# EAGLE design tulip breakout (EAGLE 9.6.2)
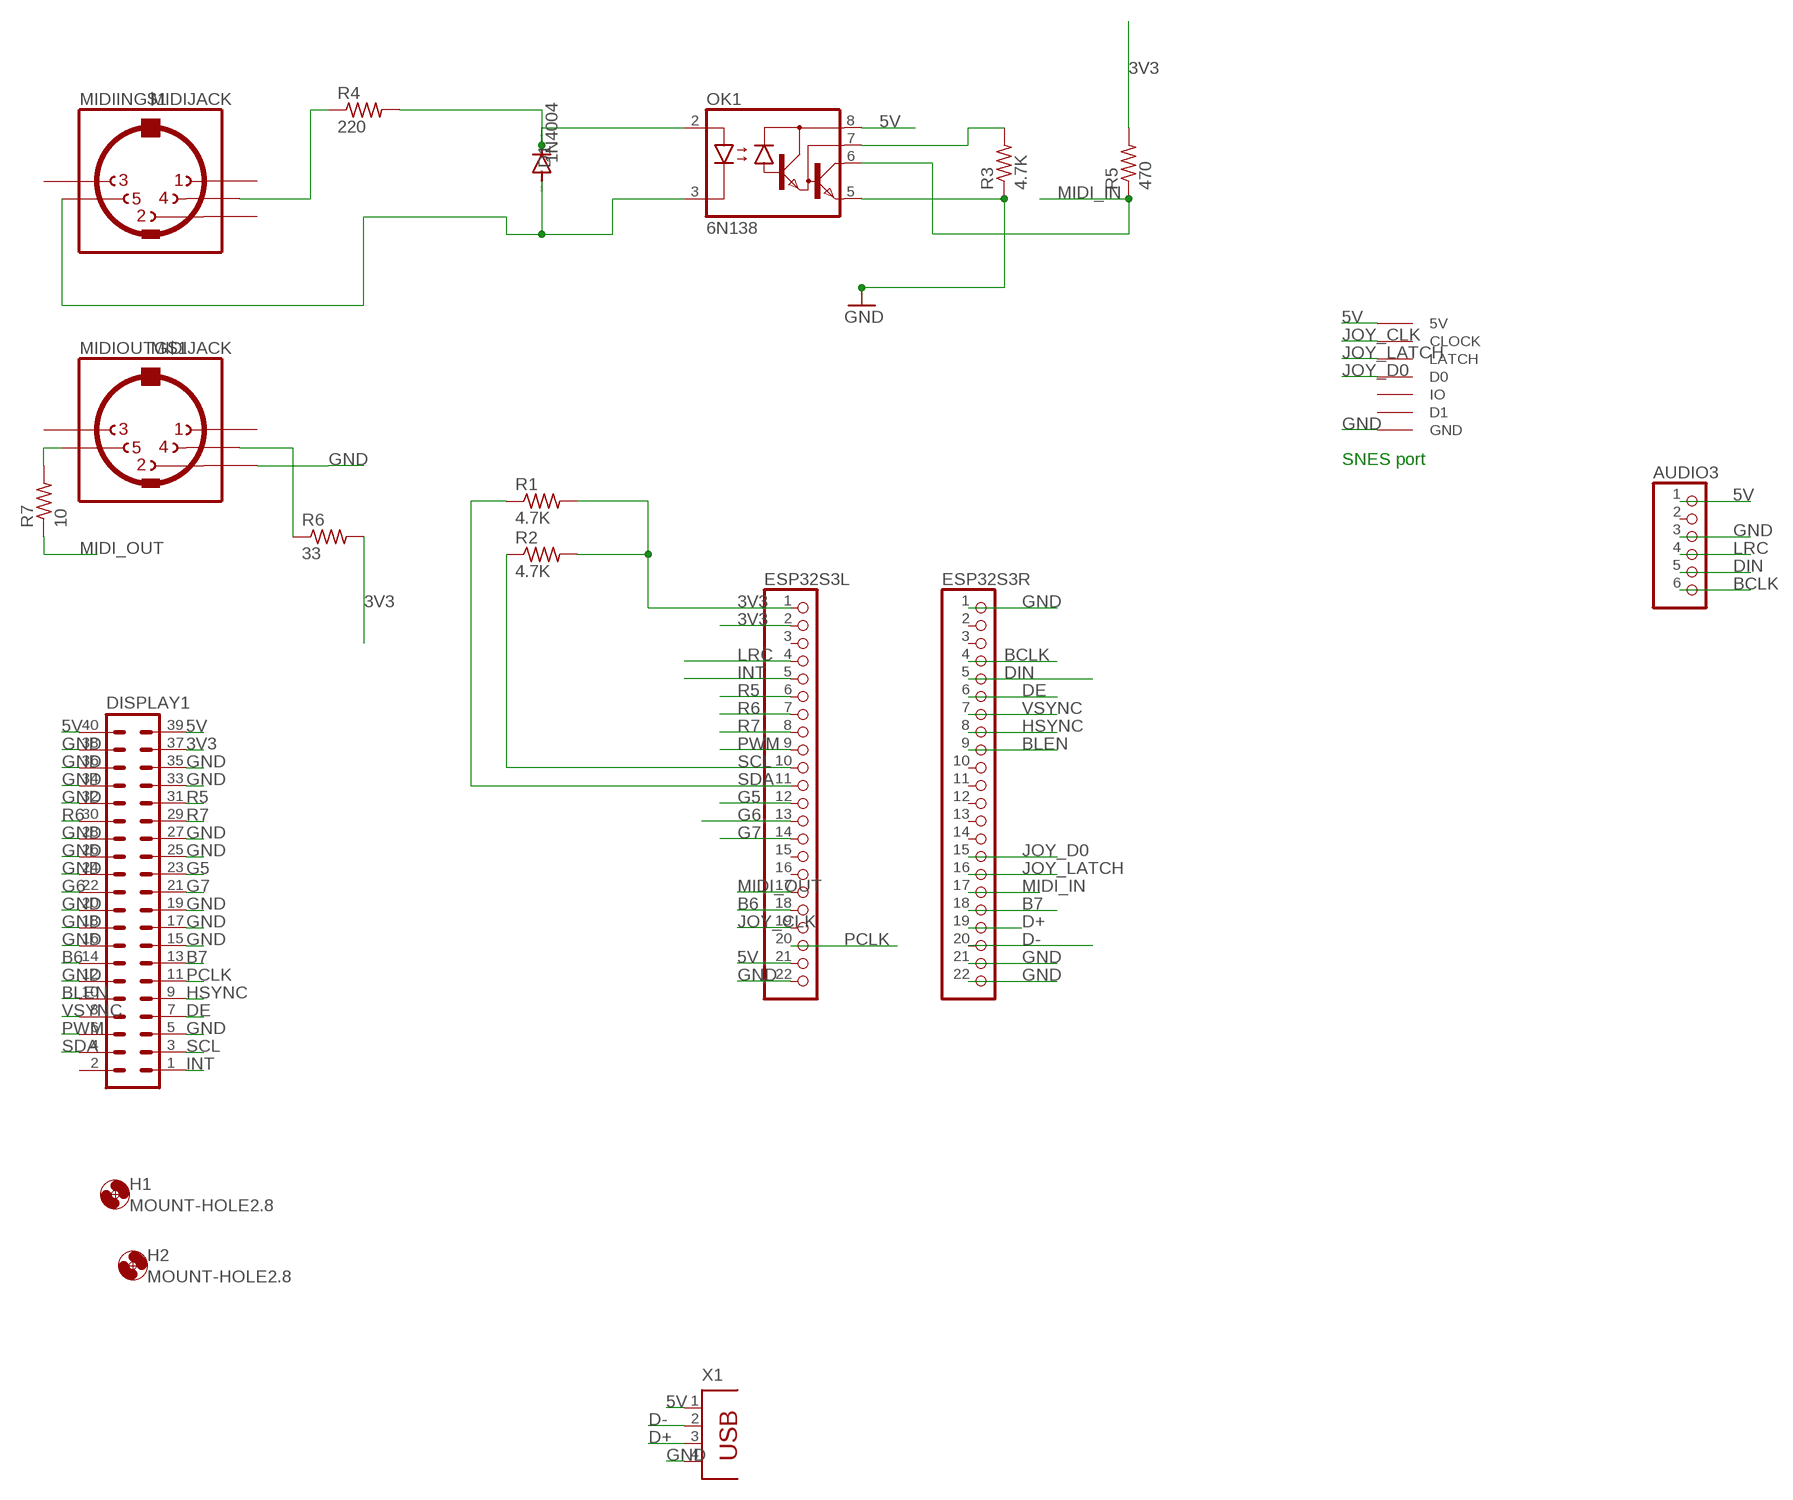
[diagram p0: schematic, sheet 1]

## Parts
AUDIO3  PINHD-1X6  [1X06]
D1  1N4004  [DO41-10]
DISPLAY1  MA20-2  [MA20-2]
ESP32S3L  PINHD-1X22  [1X22]
ESP32S3R  PINHD-1X22  [1X22]
H1  MOUNT-HOLE2.8  [2,8]
H2  MOUNT-HOLE2.8  [2,8]
MIDIIN  MIDIJACK  [CP-2350]
MIDIOUT  MIDIJACK  [CP-2350]
OK1  6N138  [DIL08]
R1  4.7K  R-US_0207/12  [0207/12]
R2  4.7K  R-US_0207/12  [0207/12]
R3  4.7K  R-US_0207/12  [0207/12]
R4  220  R-US_0207/12  [0207/12]
R5  470  R-US_0207/12  [0207/12]
R6  33  R-US_0207/12  [0207/12]
R7  10  R-US_0207/12  [0207/12]
U$2  SNESCONN  [SNESCONN]
X1  PN87520  [PN87520]

## Nets
3V3: DISPLAY1.37 ESP32S3L.1 ESP32S3L.2 R1.2 R2.2 R5.2 R6.2
5V: AUDIO3.1 DISPLAY1.39 DISPLAY1.40 ESP32S3L.21 OK1.8(VCC) U$2.5V X1.1
B6: DISPLAY1.14 ESP32S3L.18
B7: DISPLAY1.13 ESP32S3R.18
BCLK: AUDIO3.6 ESP32S3R.4
BLEN: DISPLAY1.10 ESP32S3R.9
D+: ESP32S3R.19 X1.3
D-: ESP32S3R.20 X1.2
DE: DISPLAY1.7 ESP32S3R.6
DIN: AUDIO3.5 ESP32S3R.5
G5: DISPLAY1.23 ESP32S3L.12
G6: DISPLAY1.22 ESP32S3L.13
G7: DISPLAY1.21 ESP32S3L.14
GND: AUDIO3.3 DISPLAY1.5 DISPLAY1.12 DISPLAY1.15 DISPLAY1.16 DISPLAY1.17 DISPLAY1.18 DISPLAY1.19 DISPLAY1.20 DISPLAY1.24 DISPLAY1.25 DISPLAY1.26 DISPLAY1.27 DISPLAY1.28 DISPLAY1.32 DISPLAY1.33 DISPLAY1.34 DISPLAY1.35 DISPLAY1.36 DISPLAY1.38 ESP32S3L.22 ESP32S3R.1 ESP32S3R.21 ESP32S3R.22 MIDIOUT.2 OK1.5(GND) R3.1 U$2.GND X1.4
HSYNC: DISPLAY1.9 ESP32S3R.8
INT: DISPLAY1.1 ESP32S3L.5
JOY_CLK: ESP32S3L.19 U$2.CLOCK
JOY_D0: ESP32S3R.15 U$2.D0
JOY_LATCH: ESP32S3R.16 U$2.LATCH
LRC: AUDIO3.4 ESP32S3L.4
MIDI_IN: ESP32S3R.17 OK1.6(VO) R5.1
MIDI_OUT: ESP32S3L.17 R7.1
N$29: MIDIIN.4 R4.1
N$30: D1.C OK1.2(A) R4.2
N$31: D1.A MIDIIN.5 OK1.3(C)
N$32: OK1.7(VB) R3.2
N$34: MIDIOUT.5 R7.2
N$35: MIDIOUT.4 R6.1
PCLK: DISPLAY1.11 ESP32S3L.20
PWM: DISPLAY1.6 ESP32S3L.9
R5: DISPLAY1.31 ESP32S3L.6
R6: DISPLAY1.30 ESP32S3L.7
R7: DISPLAY1.29 ESP32S3L.8
SCL: DISPLAY1.3 ESP32S3L.10 R2.1
SDA: DISPLAY1.4 ESP32S3L.11 R1.1
VSYNC: DISPLAY1.8 ESP32S3R.7
Unconnected: AUDIO3.2 DISPLAY1.2 ESP32S3L.3 ESP32S3L.15 ESP32S3L.16 ESP32S3R.2 ESP32S3R.3 ESP32S3R.10 ESP32S3R.11 ESP32S3R.12 ESP32S3R.13 ESP32S3R.14 MIDIIN.1 MIDIIN.2 MIDIIN.3 MIDIIN.PE1(MT) MIDIIN.PE2(MT) MIDIIN.PE(MT) MIDIIN.PE@(MT) MIDIOUT.1 MIDIOUT.3 MIDIOUT.PE1(MT) MIDIOUT.PE2(MT) MIDIOUT.PE(MT) MIDIOUT.PE@(MT) U$2.D1 U$2.IO

## Notes on the sheet
- SNES port

## Library data of the parts
AUDIO3 = pinhead:PINHD-1X6: PIN HEADER
D1 = diode:1N4004: DIODE general purpose rectifier, 1 A
DISPLAY1 = con-lstb:MA20-2: PIN HEADER; OC_FARNELL: unknown; OC_NEWARK: unknown
ESP32S3L ESP32S3R = pinhead:PINHD-1X22: PIN HEADER
H1 H2 = holes:MOUNT-HOLE: MOUNTING HOLE with drill center marker
MIDIIN MIDIOUT = adafruit:MIDIJACK: DIN 5 jack also known as MIDI jack A modification of conn-hirshman:MAB5SH with two options for the grounding 'teeth'
OK1 = optocoupler:6N138: MOTOROLA OPTO COUPLER; MF: VISHAY/TELEFUNKEN; MPN: 6N138; OC_FARNELL: 9860150; OC_NEWARK: 35K5294
R1-R7 = rcl:R-US_: RESISTOR, American symbol; SPICEPREFIX: R
U$2 = gamepad-conn:SNESCONN
X1 = con-berg:PN87520: BERG USB connector; OC_FARNELL: unknown; OC_NEWARK: unknown

## Board
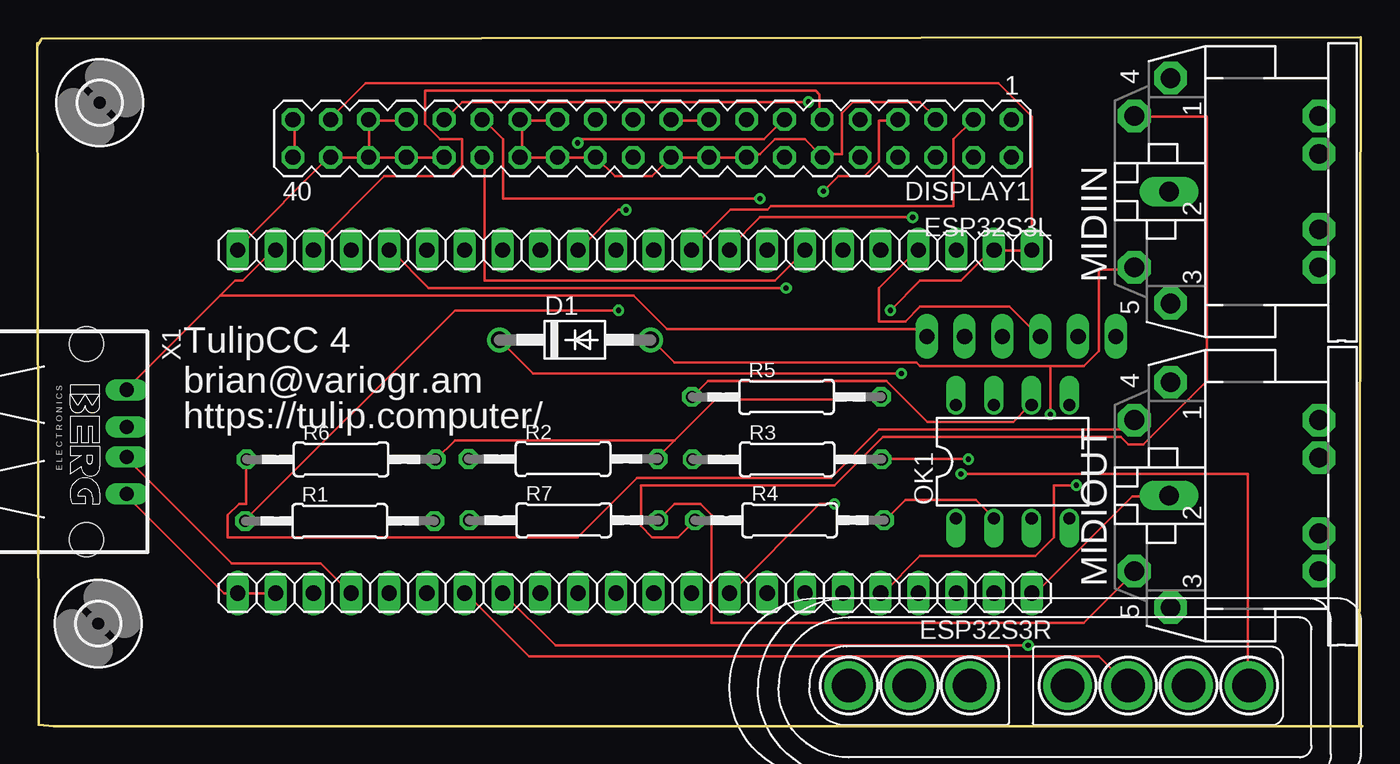
[diagram p1: board, top side]
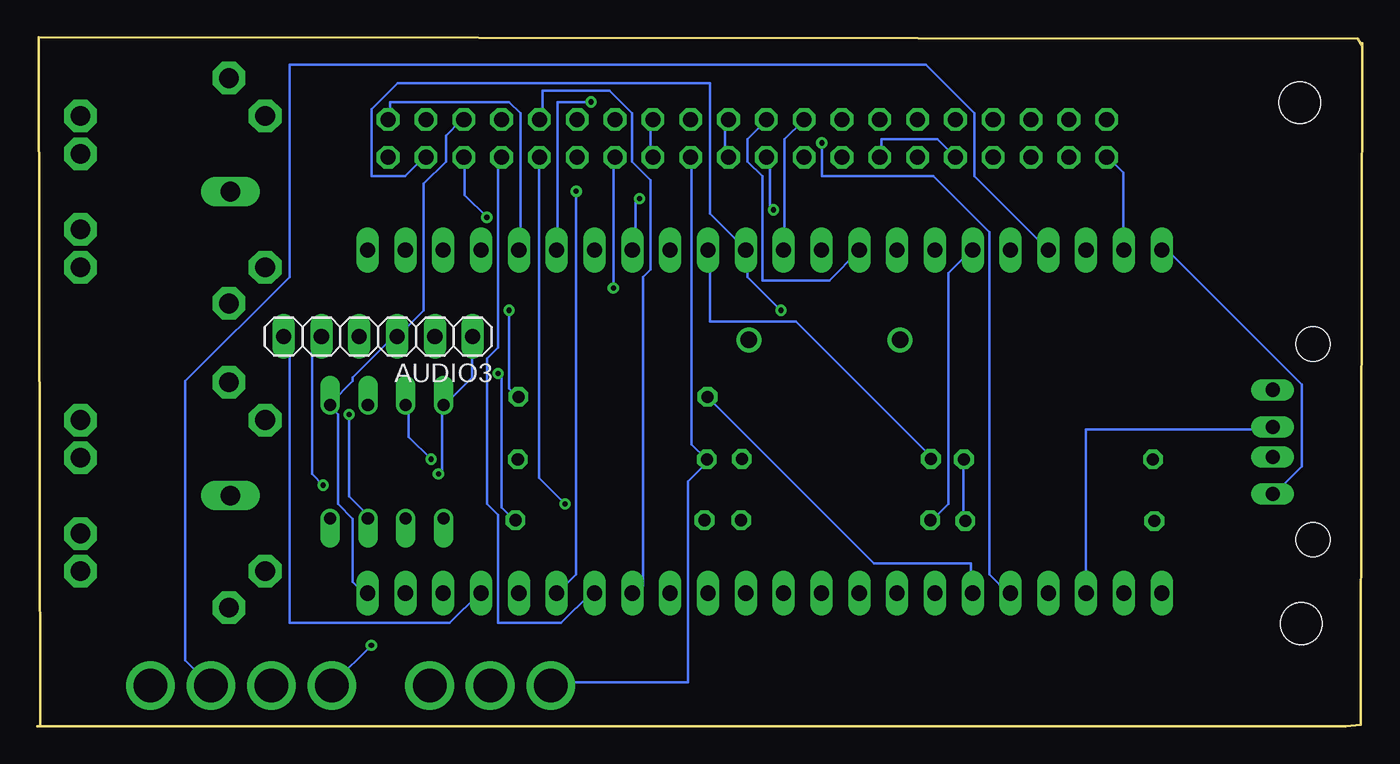
[diagram p2: board, bottom side, seen from below]

Size 89 x 46.3 mm. Coordinates in mm from the lower left corner, seen from the top.
Outline: 0,45.9 0,45.7
Outline: 0,45.7 0.1,2.8
Outline: 88.8,0 88.9,46.3 0.3,46.2 0,45.7
Outline: 89,0 1.1,0 0.1,0.1 0.1,3.3
Copper layers (1*16): Top 0.035mm / dielectric 0.15mm / Bottom 0.035mm
Design rules "default *": minimum track width 6mil, minimum drill 0.35mm, track to track 10mil, track to pad 10mil, pad to pad 10mil, via to via 10mil, smd to smd 10mil, copper to edge 40mil, drill to drill 6mil, minimum pad ring 10mil, minimum via ring 8mil, stop-mask expansion 4mil, vias tented up to drill 0mil, thermal gap 10mil

### Footprints (pad centres in the part's own frame; a part is rotated, then mirrored left to right if it is on the bottom)
1X06 = drill 1.016 long: 1 -6.35,0; 2 -3.81,0; 3 -1.27,0; 4 1.27,0; 5 3.81,0; 6 6.35,0
DO41-10 = drill 1.118: A 5.08,0; C -5.08,0
MA20-2 = drill 1.016 octagon: 1 -24.13,-1.27; 2 -24.13,1.27; 3 -21.59,-1.27; 4 -21.59,1.27; 5 -19.05,-1.27; 6 -19.05,1.27; 7 -16.51,-1.27; 8 -16.51,1.27; 9 -13.97,-1.27; 10 -13.97,1.27; 11 -11.43,-1.27; 12 -11.43,1.27; 13 -8.89,-1.27; 14 -8.89,1.27; 15 -6.35,-1.27; 16 -6.35,1.27; 17 -3.81,-1.27; 18 -3.81,1.27; 19 -1.27,-1.27; 20 -1.27,1.27; 21 1.27,-1.27; 22 1.27,1.27; 23 3.81,-1.27; 24 3.81,1.27; 25 6.35,-1.27; 26 6.35,1.27; 27 8.89,-1.27; 28 8.89,1.27; 29 11.43,-1.27; 30 11.43,1.27; 31 13.97,-1.27; 32 13.97,1.27; 33 16.51,-1.27; 34 16.51,1.27; 35 19.05,-1.27; 36 19.05,1.27; 37 21.59,-1.27; 38 21.59,1.27; 39 24.13,-1.27; 40 24.13,1.27
1X22 = drill 1.016 long: 1 -26.67,0; 2 -24.13,0; 3 -21.59,0; 4 -19.05,0; 5 -16.51,0; 6 -13.97,0; 7 -11.43,0; 8 -8.89,0; 9 -6.35,0; 10 -3.81,0; 11 -1.27,0; 12 1.27,0; 13 3.81,0; 14 6.35,0; 15 8.89,0; 16 11.43,0; 17 13.97,0; 18 16.51,0; 19 19.05,0; 20 21.59,0; 21 24.13,0; 22 26.67,0
2,8 = hole 2.8: 0,0
CP-2350 = drill 1.321 pad 2.184 octagon: 1 7.62,12.58; 3 -7.52,12.58; 4 5.08,15.02; 5 -5.08,15.02; PE -2.54,2.62; PE1 -5.08,2.62; PE2 5.08,2.62; PE@ 2.54,2.62 | drill 1.321 long: 2 0,12.68
DIL08 = drill 0.813 offset: 1 -3.81,-3.81; 2 -1.27,-3.81; 3 1.27,-3.81; 4 3.81,-3.81; 5 3.81,3.81; 6 1.27,3.81; 7 -1.27,3.81; 8 -3.81,3.81
0207/12 = drill 0.813 octagon: 1 -6.35,0; 2 6.35,0
SNESCONN = drill 2.25 pad 3.25: 5V 0,4.064; CLOCK 4.064,4.064; D0 12.192,4.064; D1 18.756,4.064; GND 26.884,4.064; IO 22.82,4.064; LATCH 8.128,4.064
PN87520 = drill 0.95 long: 1 -3.5,2.71; 2 -1,2.71; 3 1,2.71; 4 3.5,2.71 | hole 2.3: -6.57,0; 6.57,0

### Placement (x,y rotation side)
AUDIO3  66.1,26.2 180 bottom
D1  36.12,25.97 0 top
DISPLAY1  41.3,39.5 180 top
ESP32S3L  40.14,32 180 top
ESP32S3R  40.14,8.95 180 top
H1  4.1,6.9 0 top
H2  4.2,41.9 0 top
MIDIIN  88.71,35.93 90 top
MIDIOUT  88.71,15.5 90 top
OK1  65.52,17.78 0 top
R1  20.32,13.79 0 top
R2  35.32,17.97 0 top
R3  50.37,17.94 0 top
R4  50.53,13.85 0 top
R5  50.33,22.14 0 top
R6  20.41,17.94 0 top
R7  35.37,13.85 0 top
U$2  81.4,6.8 180 top
X1  3.31,19.11 270 top

### Tracks (layer width: path | path; a pad name or v marks a point on that pad's centre or on a via)
3V3  (via drill 0.35)
  Top 0.152: 42.8,19.2 45.55,21.95 56.55,21.95 R5.2 | 42.8,19.2 41.8,18.2 R2.2 | 42.8,19.2 28.05,19.2 26.8,17.95 R6.2 | DISPLAY1.37 19.8,40.95 22.05,43.2 64.55,43.2 66.8,40.95 66.8,32.2 ESP32S3L.1 66.8,31.95 64.3,31.95 ESP32S3L.2 64.05,31.95 62.05,29.95 59.3,29.95 v57.3,27.95
  Bottom 0.152: R1.2 26.8,13.95 26.8,17.7 R6.2 | v57.3,27.95 57.3,22.7 56.8,22.2 R5.2
5V  (via drill 0.35)
  Top 0.152: DISPLAY1.40 17.3,38.45 17.3,40.7 DISPLAY1.39 | 12.3,28.95 13.3,29.95 13.8,29.95 15.8,31.95 ESP32S3L.21 | 12.3,28.95 6.05,22.7 X1.1 | 12.3,28.95 40.05,28.95 42.3,26.7 59.05,26.7 59.55,26.2 AUDIO3.1 | v62.05,16.95 81.3,16.95 81.3,2.95 U$2.5V
  Bottom 0.152: AUDIO3.1 59.8,26.2 59.8,23.45 61.55,21.7 OK1.8 61.8,21.45 61.8,17.2 v62.05,16.95 | DISPLAY1.40 17.05,38.2 16.05,37.2 16.05,32.2 ESP32S3L.21
B6  (via drill 0.35)
  Top 0.152: v50.3,29.45 26.3,29.45 23.8,31.95 ESP32S3L.18
  Bottom 0.152: v50.3,29.45 50.3,38.2 DISPLAY1.14
B7  (via drill 0.35)
  Top 0.152: v36.3,39.2 36.55,39.45 48.8,39.45 50.05,40.7 DISPLAY1.13
  Bottom 0.152: v36.3,39.2 36.3,36.95 28.8,36.95 25.05,33.2 25.05,10.2 23.8,8.95 ESP32S3R.18
BCLK
  Bottom 0.152: ESP32S3R.4 59.3,8.95 61.3,6.95 72.05,6.95 72.05,25.95 72.3,26.2 AUDIO3.6
BLEN  (via drill 0.35)
  Top 0.152: v53.55,14.95 52.55,14.95 46.55,8.95 ESP32S3R.9
  Bottom 0.152: v53.55,14.95 55.3,16.7 55.3,38.2 DISPLAY1.10
D+
  Top 0.152: X1.3 6.05,17.95 13.05,10.95 19.05,10.95 21.05,8.95 ESP32S3R.19
D-
  Bottom 0.152: ESP32S3R.20 18.55,19.95 6.05,19.95 X1.2
DE  (via drill 0.35)
  Top 0.152: v52.8,35.95 53.8,36.95 55.55,36.95 56.55,37.95 56.55,40.7 57.8,40.7 DISPLAY1.7
  Bottom 0.152: v52.8,35.95 52.8,10.2 54.05,8.95 ESP32S3R.6
DIN  (via drill 0.35)
  Top 0.152: v69.8,16.2 68.3,16.2 68.3,12.7 67.05,11.45 59.3,11.45 56.8,8.95 ESP32S3R.5
  Bottom 0.152: v69.8,16.2 70.55,16.95 70.55,25.7 70.05,26.2 AUDIO3.5
G5
  Bottom 0.152: ESP32S3L.12 38.8,32.2 38.8,39.45 37.55,40.7 DISPLAY1.23
G6  (via drill 0.35)
  Top 0.152: v39.55,34.7 39.05,34.7 36.55,32.2 ESP32S3L.13
  Bottom 0.152: v39.55,34.7 39.8,34.95 39.8,38.2 DISPLAY1.22
G7
  Bottom 0.152: ESP32S3L.14 33.8,31.95 35.8,29.95 40.3,29.95 40.3,36.95 41.3,37.95 41.3,39.45 40.05,40.7 DISPLAY1.21
GND
  Top 0.152: X1.4 6.05,15.45 12.55,8.95 ESP32S3R.22 ESP32S3R.21 | 22.3,40.7 24.55,40.7 DISPLAY1.33 | DISPLAY1.36 22.3,38.2 24.55,38.2 DISPLAY1.34 24.8,38.2 27.3,38.2 DISPLAY1.32 | 22.3,40.7 22.3,38.45 DISPLAY1.36 | 22.3,40.7 DISPLAY1.35 | ESP32S3L.22 13.55,32.2 19.55,38.2 DISPLAY1.38 19.8,38.2 22.05,38.2 DISPLAY1.36 | ESP32S3R.1 67.05,8.95 73.55,15.45 75.8,15.45 MIDIOUT.2 | 32.55,40.7 34.8,40.7 DISPLAY1.25 | 32.55,40.7 32.55,38.45 DISPLAY1.28 32.55,38.2 34.8,38.2 DISPLAY1.26 35.05,38.2 37.3,38.2 DISPLAY1.24 37.55,38.2 38.8,36.95 41.3,36.95 42.55,38.2 DISPLAY1.20 42.8,38.2 45.05,38.2 DISPLAY1.18 45.3,38.2 47.55,38.2 DISPLAY1.16 47.8,38.45 48.55,38.45 49.55,39.45 51.55,39.45 52.55,38.45 DISPLAY1.12 52.8,38.45 54.05,38.45 54.05,41.2 54.8,41.95 59.3,41.95 60.3,40.95 DISPLAY1.5 | 32.55,40.7 DISPLAY1.27 | DISPLAY1.19 42.8,40.7 45.05,40.7 DISPLAY1.17
  Bottom 0.152: X1.4 5.8,15.7 4.05,17.45 4.05,22.95 13.3,32.2 ESP32S3L.22 | ESP32S3R.1 67.05,8.95 67.8,9.7 67.8,13.95 68.8,14.95 68.8,20.95 69.3,21.45 OK1.5 69.3,21.7 67.8,23.2 67.8,23.45 65.05,26.2 AUDIO3.3 64.8,26.2 63.05,27.95 63.05,36.45 61.55,37.95 61.55,39.7 60.55,40.7 DISPLAY1.5 | DISPLAY1.18 45.05,38.2 45.05,18.95 44.05,17.95 R3.1 44.05,17.7 45.3,16.45 45.3,2.95 54.3,2.95 U$2.GND | DISPLAY1.15 47.8,40.7 47.8,38.45 DISPLAY1.16 | DISPLAY1.19 42.8,40.7 42.8,38.45 DISPLAY1.20 | DISPLAY1.32 28.55,39.45 32.3,39.45 32.3,38.45 DISPLAY1.28
HSYNC
  Bottom 0.152: ESP32S3R.8 48.8,8.95 48.3,9.45 48.3,30.2 47.8,30.7 47.8,36.7 49.05,37.95 49.05,41.2 50.55,42.7 55.05,42.7 55.05,40.95 DISPLAY1.9
INT
  Bottom 0.152: ESP32S3L.5 56.55,32.2 56.55,41.2 57.3,41.95 65.3,41.95 65.3,40.95 DISPLAY1.1
JOY_CLK
  Bottom 0.152: U$2.CLOCK 79.05,4.45 79.05,23.2 72.05,30.2 72.05,44.45 29.3,44.45 26.05,41.2 26.05,36.95 21.3,32.2 ESP32S3L.19
JOY_D0  (via drill 0.35)
  Top 0.152: v66.55,5.45 34.8,5.45 31.3,8.95 ESP32S3R.15
  Bottom 0.152: v66.55,5.45 69.05,2.95 U$2.D0
JOY_LATCH
  Top 0.152: ESP32S3R.16 28.8,8.95 33.05,4.7 71.3,4.7 73.05,2.95 U$2.LATCH
LRC
  Top 0.152: ESP32S3L.4 59.05,31.95 56.55,29.45 56.55,27.2 58.3,27.2 59.3,28.2 65.3,28.2 67.3,26.2 AUDIO3.4
MIDI_IN
  Top 0.152: OK1.6 66.55,21.45 65.55,20.45 59.8,20.45 57.05,23.2 45.05,23.2 44.05,22.2 R5.1
  Bottom 0.152: R5.1 43.8,21.95 32.8,10.95 26.3,10.95 26.3,8.95 ESP32S3R.17
MIDI_OUT
  Bottom 0.152: R7.1 28.8,13.95 27.8,14.95 27.8,30.45 26.3,31.95 ESP32S3L.17
N$29
  Top 0.152: R4.1 44.05,13.7 43.05,12.7 41.3,12.7 40.55,13.45 40.55,16.2 53.55,16.2 56.8,19.45 72.8,19.45 73.3,18.95 74.3,18.95 78.55,23.2 78.55,40.95 73.8,40.95 MIDIIN.4
N$30  (via drill 0.35)
  Top 0.152: R4.2 57.05,13.95 58.3,15.2 63.05,15.2 64.05,14.2 OK1.2 | v58.05,23.7 33.3,23.7 31.05,25.95 D1.C
  Bottom 0.152: v58.05,23.7 57.8,23.45 57.8,14.7 57.05,13.95 R4.2
N$31  (via drill 0.35)
  Top 0.152: 68.05,24.2 v68.05,20.95 | 68.05,24.2 70.3,24.2 71.3,25.2 71.3,30.7 73.55,30.7 MIDIIN.5 | 68.05,24.2 59.3,24.2 59.05,24.45 42.8,24.45 41.3,25.95 D1.A
  Bottom 0.152: v68.05,20.95 68.05,15.45 66.8,14.2 OK1.3
N$32  (via drill 0.35)
  Top 0.152: v62.55,17.95 56.8,17.95 R3.2
  Bottom 0.152: v62.55,17.95 64.05,19.45 64.05,21.45 OK1.7
N$34
  Top 0.152: R7.2 41.8,13.95 42.8,14.95 44.55,14.95 45.3,14.2 45.3,6.95 70.3,6.95 73.55,10.2 MIDIOUT.5
N$35
  Top 0.152: R6.1 14.05,17.7 14.05,14.95 13.55,14.95 12.8,14.2 12.8,12.7 36.3,12.7 40.3,16.7 53.3,16.7 56.55,19.95 73.05,19.95 73.55,20.45 MIDIOUT.4
PCLK
  Top 0.152: ESP32S3L.20 18.55,32.2 23.3,36.95 27.8,36.95 28.55,37.7 28.55,39.45 27.05,39.45 26.05,40.45 26.05,42.7 52.3,42.7 52.55,42.45 52.55,40.95 DISPLAY1.11
PWM  (via drill 0.35)
  Top 0.152: v58.8,34.2 48.55,34.2 46.55,32.2 ESP32S3L.9
  Bottom 0.152: v58.8,34.2 60.3,35.7 60.3,38.2 DISPLAY1.6
R5  (via drill 0.35)
  Top 0.152: v51.8,41.95 28.55,41.95 27.55,40.95 DISPLAY1.31
  Bottom 0.152: v51.8,41.95 54.05,41.95 54.05,32.2 ESP32S3L.6
R6
  Top 0.152: DISPLAY1.30 30.05,38.2 30.05,29.95 49.55,29.95 51.55,31.95 ESP32S3L.7
R7  (via drill 0.35)
  Top 0.152: v48.55,35.45 31.3,35.45 31.3,39.45 30.05,40.7 DISPLAY1.29
  Bottom 0.152: v48.55,35.45 48.8,35.2 48.8,32.2 ESP32S3L.8
SCL
  Top 0.152: DISPLAY1.3 62.8,40.7 61.55,39.45 61.55,34.95 49.3,34.95 49.05,34.7 46.55,34.7 44.05,32.2 ESP32S3L.10
  Bottom 0.152: R2.1 29.05,18.2 38.05,27.2 43.8,27.2 43.8,31.95 ESP32S3L.10
SDA  (via drill 0.35)
  Top 0.152: v39.05,27.95 28.05,27.95 14.05,13.95 R1.1
  Bottom 0.152: v39.05,27.95 41.3,30.2 41.3,31.95 ESP32S3L.11 41.55,32.2 43.8,34.45 43.8,43.2 64.8,43.2 66.55,41.45 66.55,36.95 64.3,36.95 63.05,38.2 DISPLAY1.4
VSYNC
  Bottom 0.152: ESP32S3R.7 51.8,8.95 53.8,6.95 58.05,6.95 58.05,14.2 58.8,14.95 58.8,24.7 58.05,25.45 58.05,38.2 DISPLAY1.8

### Text on the board
tPlace: TulipCC 4 / brian@variogr.am | https://tulip.computer/